# EAGLE design USBASP (EAGLE 6.3)
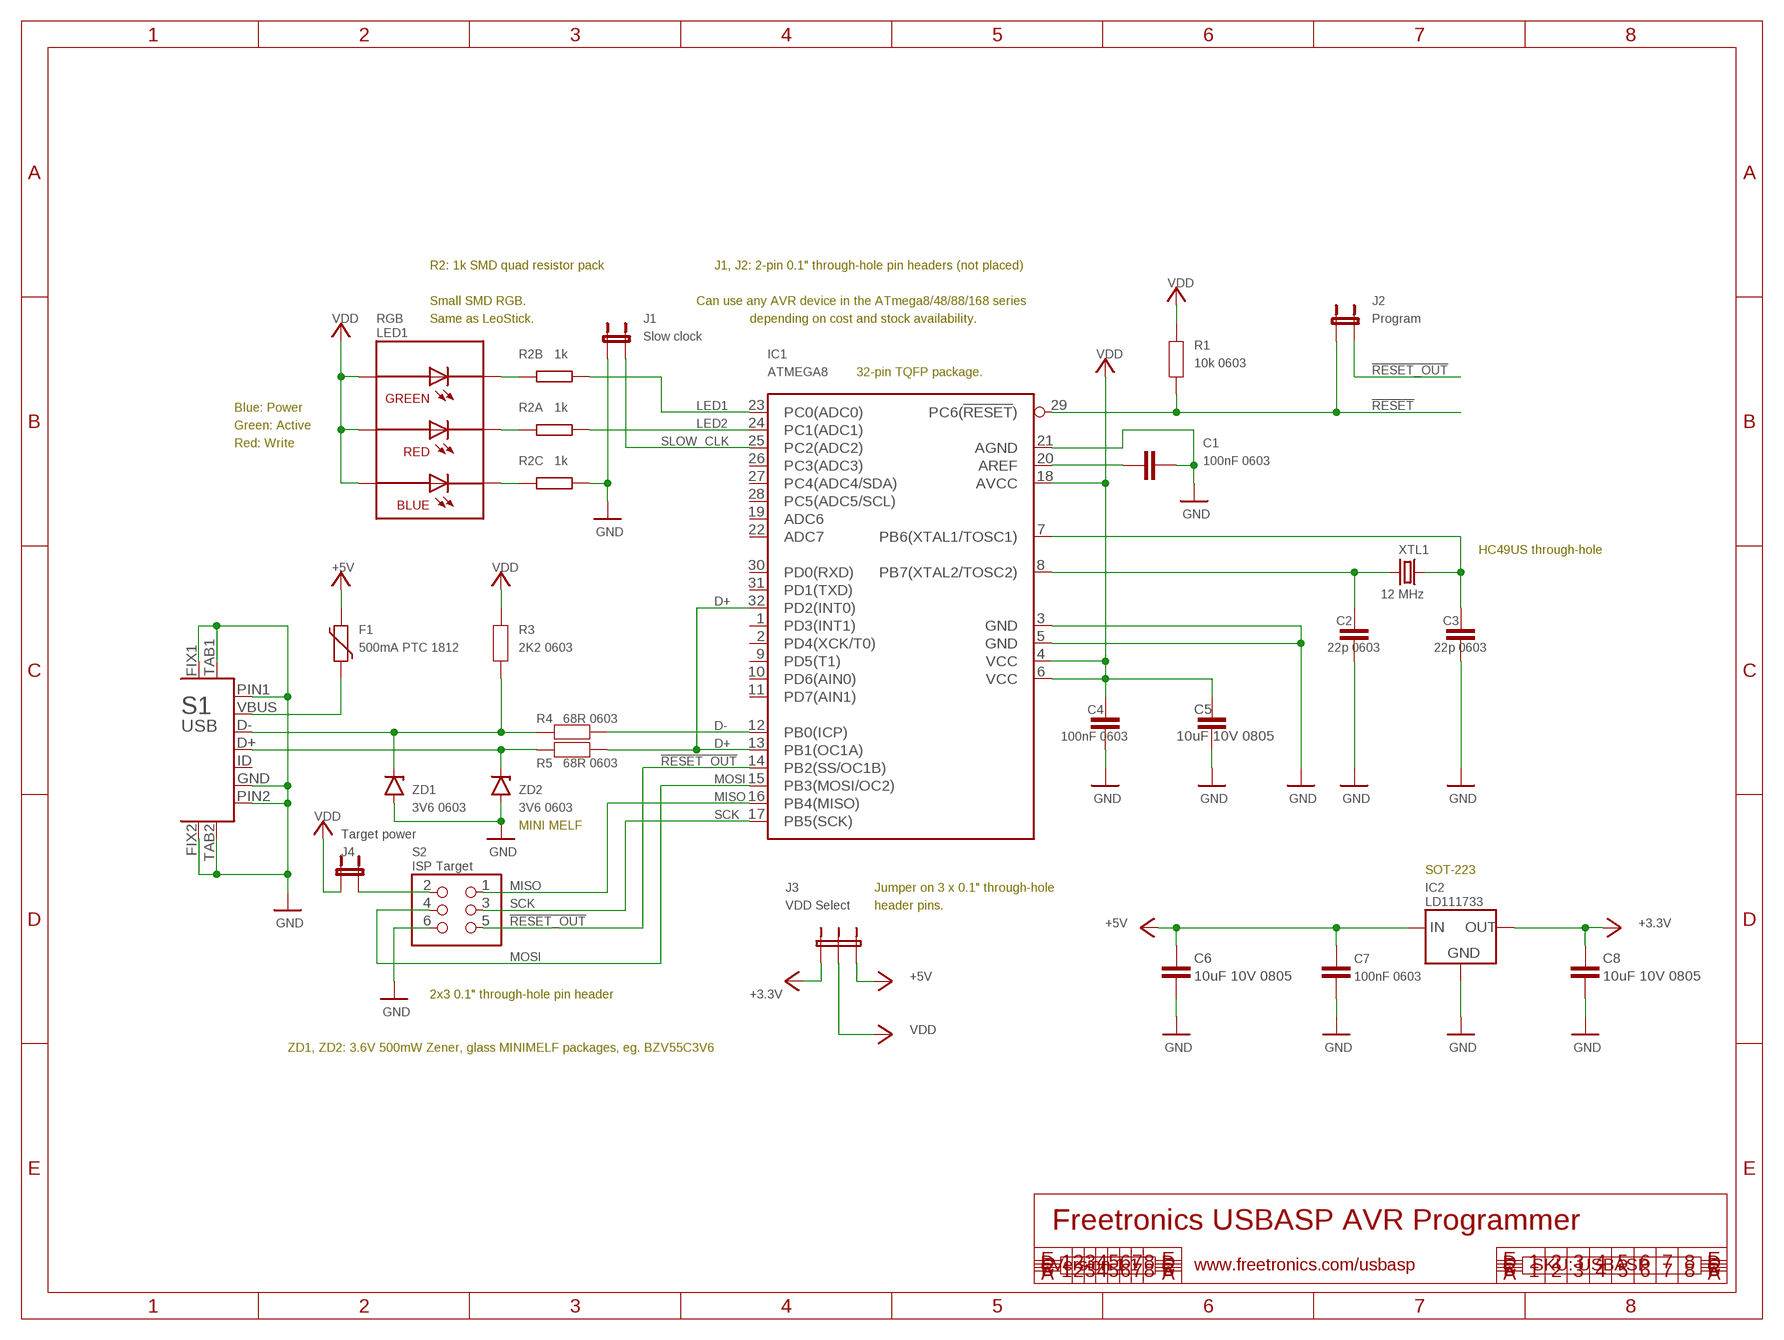
[diagram p0: schematic, sheet 1]

## Parts
C1  100nF 0603  CAP0603  [0603]
C2  22p 0603  CAP0603  [0603]
C3  22p 0603  CAP0603  [0603]
C4  100nF 0603  CAP0603  [0603]
C5  10uF 10V 0805  C-EUC0805  [C0805]
C6  10uF 10V 0805  C-EUC0805  [C0805]
C7  100nF 0603  CAP0603  [0603]
C8  10uF 10V 0805  C-EUC0805  [C0805]
F1  500mA PTC 1812  PTC  [1812]
IC1  ATMEGA8  ATMEGA168  [TQFP32-08]
IC2  LD111733  LD1117-FIXED  [SOT-223]
J1  Slow clock  JUMPER_PTH  [HEADER_1X02]
J2  Program  JUMPER_PTH  [HEADER_1X02]
J3  VDD Select  JUMPER_SPDT  [JUMPER_SPDT]
J4  Target power  JUMPER_PTH  [HEADER_1X02]
LED1  RGB  RGBLEDSMT  [19-337]
R1  10k 0603  RESISTOR0603  [0603]
R2  1k  CAY16  [CAY16]
R3  2K2 0603  RESISTOR0603  [0603]
R4  68R 0603  RESISTOR0603  [0603]
R5  68R 0603  RESISTOR0603  [0603]
S1  USB  USB-6PSMT  [USB-MICROB-MB05PMXX]
S2  ISP Target  HEADER_2X3  [HEADER_2X3]
XTL1  12 MHz  CRYSTALHC49US  [HC49US]
ZD1  3V6 0603  ZENERMINIMELF  [MINIMELF]
ZD2  3V6 0603  ZENERMINIMELF  [MINIMELF]

## Nets
!RESET: IC1.29(PC6(!RESET!)) J2.1 R1.1
!RESET_OUT: IC1.14(PB2(SS/OC1B)) J2.2 S2.5
+3V3: C8.1 IC2.2(OUT) IC2.4(OUT) J3.1 ; supply symbol labelled +3.3V
+5V: C6.1 C7.1 F1.2 IC2.3(IN) J3.3
D+: IC1.13(PB1(OC1A)) IC1.32(PD2(INT0)) R5.1
D-: IC1.12(PB0(ICP)) R4.1
GND: C1.2 C2.1 C3.1 C4.2 C5.2 C6.2 C7.2 C8.2 IC1.3(GND) IC1.5(GND) IC1.21(AGND) IC2.1(GND) J1.1 R2.3 S1.FIX1 S1.FIX2 S1.GND S1.PIN1 S1.PIN2 S1.TAB1 S1.TAB2 S2.6 ZD1.A ZD2.A
LED1: IC1.23(PC0(ADC0)) R2.2
LED2: IC1.24(PC1(ADC1)) R2.1
MISO: IC1.16(PB4(MISO)) S2.1
MOSI: IC1.15(PB3(MOSI/OC2)) S2.4
N$1: LED1.1(C-B) R2.6
N$2: LED1.2(C-R) R2.8
N$3: LED1.3(C-G) R2.7
N$4: J4.2 S2.2
N$138: C3.2 IC1.7(PB6(XTAL1/TOSC1)) XTL1.2
N$139: C2.2 IC1.8(PB7(XTAL2/TOSC2)) XTL1.1
N$141: F1.1 S1.VBUS
N$142: C1.1 IC1.20(AREF)
N$143: R5.2 S1.D+ ZD2.K
N$144: R3.1 R4.2 S1.D- ZD1.K
SCK: IC1.17(PB5(SCK)) S2.3
SLOW_CLK: IC1.25(PC2(ADC2)) J1.2
VDD: C4.1 C5.1 IC1.4(VCC) IC1.6(VCC) IC1.18(AVCC) J3.2 J4.1 LED1.4(A-B) LED1.5(A-R) LED1.6(A-G) R1.2 R3.2
Unconnected: IC1.1(PD3(INT1)) IC1.2(PD4(XCK/T0)) IC1.9(PD5(T1)) IC1.10(PD6(AIN0)) IC1.11(PD7(AIN1)) IC1.19(ADC6) IC1.22(ADC7) IC1.26(PC3(ADC3)) IC1.27(PC4(ADC4/SDA)) IC1.28(PC5(ADC5/SCL)) IC1.30(PD0(RXD)) IC1.31(PD1(TXD)) R2.4 R2.5 S1.ID

## Notes on the sheet
- R2: 1k SMD quad resistor pack | J1, J2: 2-pin 0.1" through-hole pin headers (not placed)
- Small SMD RGB. | Can use any AVR device in the ATmega8/48/88/168 series
- Same as LeoStick. | depending on cost and stock availability.
- 32-pin TQFP package.
- Blue: Power
- Green: Active
- Red: Write
- HC49US through-hole
- MINI MELF
- SOT-223
- Jumper on 3 x 0.1" through-hole
- header pins.
- 2x3 0.1" through-hole pin header
- ZD1, ZD2: 3.6V 500mW Zener, glass MINIMELF packages, eg. BZV55C3V6
- Freetronics USBASP AVR Programmer
- Version 1.1 | www.freetronics.com/usbasp | SKU: USBASP

## Library data of the parts
C1-C4 C7 = freetronics-master-v1:CAP: Capacitor Standard 0603 ceramic capacitor, and 0.1" leaded capacitor.
C5 C6 C8 = freetronics-jon:C-EU: CAPACITOR, European symbol
F1 = freetronics-luke:PTC: Polymeric PTC ("Polyfuse")
IC1 = freetronics-luke:ATMEGA168
IC2 = freetronics-luke:LD1117-FIXED: Fixed-voltage LD1117 series LDOs in SOT-223 package. Note that the ground pin is labelled as ground, not as adj, because it's not the adjustable-voltage part.
J1 J2 J4 = freetronics-luke:JUMPER_PTH: 2-pin (SPST) jumper header, 0.1" pitch through-hole.
J3 = freetronics-luke:JUMPER_SPDT: 3-pin (SPDT) jumper header, 0.1" pitch through-hole.
LED1 = freetronics-master-v1:RGBLED
R1 R3-R5 = freetronics-master-v1:RESISTOR: Resistor Basic schematic elements and footprints for 0603, 1206, and PTH 1/10th watt (small) resistors.
R2 = freetronics-luke:CAY16
S1 = freetronics-jon:USB-6P
S2 = freetronics-luke:HEADER_2X3: 6-pin (2x3) 0.1" male through-hole pin header.
XTL1 = freetronics-master-v1:CRYSTAL: Crystals Various standard crystals. Proven footprints. Spark Fun Electronics SKU : COM-00534
ZD1 ZD2 = freetronics-luke:ZENER

## Net classes
0 default: width 0.152 mm, drill 0.241 mm, clearance 0.152 mm
1 POWER: width 0.305 mm

## Board
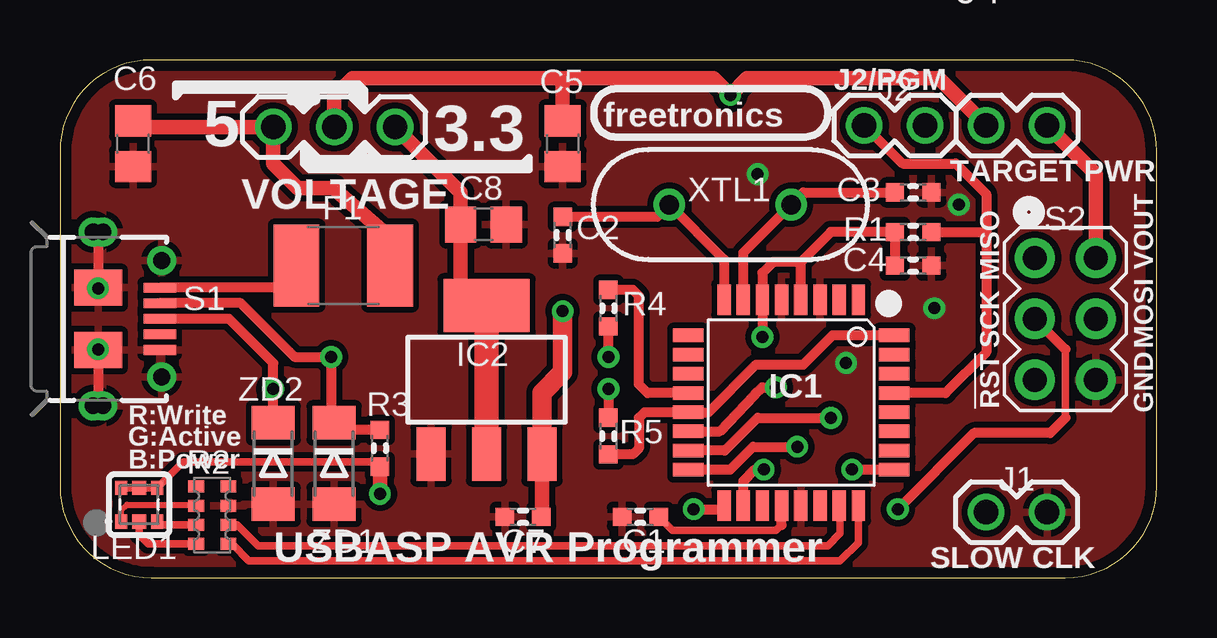
[diagram p1: board, top side]
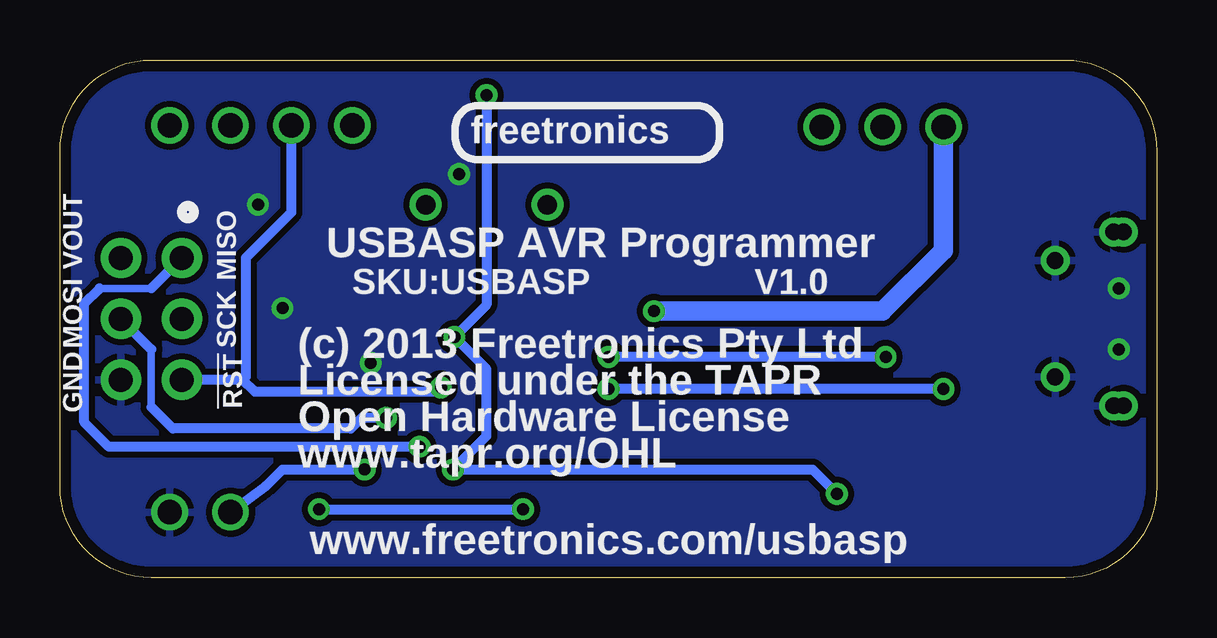
[diagram p2: board, bottom side, seen from below]

Size 45.72 x 21.59 mm. Coordinates in mm from the lower left corner, seen from the top.
Outline: 0,3.81 arc90 3.81,0 41.91,0 arc90 45.72,3.81 45.72,17.78 arc90 41.91,21.59 3.81,21.59 arc90 0,17.78 0,3.81
Copper layers (1*16): Top 0.035mm / dielectric 1.5mm / Bottom 0.035mm
Design rules "default": minimum track width 10mil, minimum drill 15mil, track to track 10mil, track to pad 10mil, pad to pad 10mil, via to via 10mil, smd to smd 8mil, copper to edge 18mil, drill to drill 8mil, minimum pad ring 10mil, minimum via ring 8mil, stop-mask expansion 4mil, vias tented up to drill 25mil, thermal gap 10mil

### Footprints (pad centres in the part's own frame; a part is rotated, then mirrored left to right if it is on the bottom)
0603 = smd 0.762 x 0.762: 1 -0.762,0; 2 0.762,0
C0805 = smd 1.3 x 1.5: 1 -0.95,0; 2 0.95,0
1812 = smd 1.9 x 3.4: 1 -1.95,0; 2 1.95,0
TQFP32-08 = smd 1.27 x 0.559: 1 -4.293,2.8; 2 -4.293,2; 3 -4.293,1.2; 4 -4.293,0.4; 5 -4.293,-0.4; 6 -4.293,-1.2; 7 -4.293,-2; 8 -4.293,-2.8; 17 4.293,-2.8; 18 4.293,-2; 19 4.293,-1.2; 20 4.293,-0.4; 21 4.293,0.4; 22 4.293,1.2; 23 4.293,2; 24 4.293,2.8 | smd 0.559 x 1.27: 9 -2.8,-4.293; 10 -2,-4.293; 11 -1.2,-4.293; 12 -0.4,-4.293; 13 0.4,-4.293; 14 1.2,-4.293; 15 2,-4.293; 16 2.8,-4.293; 25 2.8,4.293; 26 2,4.293; 27 1.2,4.293; 28 0.4,4.293; 29 -0.4,4.293; 30 -1.2,4.293; 31 -2,4.293; 32 -2.8,4.293
SOT-223 = smd 1.219 x 2.235: 1 -2.311,-3.099; 2 0,-3.099; 3 2.311,-3.099 | smd 3.6 x 2.2: 4 0,3.099
HEADER_1X02 = drill 1.016: 1 -1.27,0; 2 1.27,0
JUMPER_SPDT = drill 1.016: 1 -2.54,0; 2 0,0; 3 2.54,0
19-337 = smd 0.6 x 0.5: 1 -0.7,0.75; 3 -0.7,-0.75; 4 0.7,0.75; 6 0.7,-0.75 | smd 0.6 x 0.6: 2 -0.7,0; 5 0.7,0
CAY16 = smd 0.5 x 0.65: 1 -1.2,-0.675; 2 -0.4,-0.675; 3 0.4,-0.675; 4 1.2,-0.675; 5 1.2,0.675; 6 0.4,0.675; 7 -0.4,0.675; 8 -1.2,0.675
USB-MICROB-MB05PMXX = smd 0.4 x 1.35: D+ 0,2.575; D- -0.65,2.575; GND 1.3,2.575; ID 0.65,2.575; VBUS -1.3,2.575 | smd 1.5 x 2: FIX1 -1.3,0; FIX2 1.3,0 | drill 0.7: PIN1 -2.425,2.65; PIN2 2.425,2.65; SLOT1 -3.625,-0.2; SLOT2 3.625,-0.2; TAB1 -3.625,0.2; TAB2 3.625,0.2
HEADER_2X3 = drill 1 pad 1.676: 1 -2.54,-1.27; 2 -2.54,1.27; 3 0,-1.27; 4 0,1.27; 5 2.54,-1.27; 6 2.54,1.27
HC49US = drill 0.813: 1 -2.54,0; 2 2.54,0
MINIMELF = smd 1.4 x 1.8: A 1.7,0; K -1.7,0

### Placement (x,y rotation side)
C1  24.19,2.54 180 top
C2  20.95,14.29 90 top
C3  35.56,16.07 180 top
C4  35.56,13.02 0 top
C5  20.95,18.1 270 top
C6  3.05,18.1 270 top
C7  19.3,2.54 180 top
C8  17.65,14.73 0 top
F1  11.81,13.02 0 top
IC1  30.48,7.3 270 top
IC2  17.78,8.26 0 top
J1  39.88,2.73 180 top
J2  34.8,18.86 0 top
J3  11.43,18.8 180 top
J4  39.88,18.86 0 top
LED1  3.3,3.05 90 top
R1  35.56,14.41 180 top
R2  6.35,2.6 90 top
R3  13.34,5.4 270 top
R4  22.86,11.24 270 top
R5  22.86,5.91 90 top
S1  1.59,10.79 270 top
S2  41.91,10.79 270 top
XTL1  27.94,15.56 0 top
ZD1  11.43,4.76 270 top
ZD2  8.89,4.76 270 top

### Tracks (layer width: path | path; a pad name or v marks a point on that pad's centre or on a via)
!RESET
  Top 0.406: IC1.29 36.91,7.7 38.61,9.4 38.61,14.48 | R1.1 38.54,14.41 38.61,14.48 | J2.1 35.12,17.27 37.34,17.27 38.61,16 38.61,14.48
!RESET_OUT  (via drill 0.5)
  Top 0.406: v29.84,7.94 29.27,7.94 28.96,7.62 27.5,6.1 IC1.14
  Bottom 0.406: 38.1,8.26 S2.5 | 38.1,8.26 37.97,8.38 37.97,13.34 36.07,15.24 J2.2 | v29.84,7.94 30.04,7.75 37.59,7.75 38.1,8.26
+3V3
  Top 0.406: 16.7,11.94 16.7,11.55 17.14,11.11 17.7,11.11
  Top 0.61: 16.7,11.94 C8.1 16.7,16.06 J3.1
  Top 0.813: IC2.4 17.78,11.11
  Top 1.016: 16.7,11.94 16.51,11.75 | 17.7,11.11 17.78,11.11 IC2.2
+5V  (via drill 0.5)
  Top 0.305: C7.1 20.09,2.54
  Top 0.406: C7.1 20.09,2.54
  Top 0.61: 20.09,2.54 IC2.3 | 13.76,14.18 11.68,16 11.43,16.26 9.91,16.26 8.89,17.27 J3.3 3.3,18.8 C6.1
  Top 0.813: v20.95,11.11 20.95,8.57 20.09,7.71 IC2.3 | F1.2 13.76,14.18
  Bottom 0.813: v20.95,11.11 11.43,11.11 8.89,13.65 J3.3
D+
  Top 0.406: R5.1 23.88,5.14 24.13,5.4 24.13,6.67 24.36,6.9 IC1.13 27.03,6.9 29.02,8.89 30.99,8.89 32.2,10.1 IC1.32
D-
  Top 0.406: R4.1 23.88,12 24.13,11.75 24.13,8.06 24.49,7.7 IC1.12
GND  (via drill 0.5)
  Top 0.406: S1.FIX2 1.59,7.17 S1.TAB2 | S1.TAB1 1.59,14.42 S1.FIX1
  other vias: 32.77,8.95 37.47,15.56 36.45,11.24 1.59,9.53 1.59,12.06 29.08,16.83
  pour Top: 0,21.59 45.72,21.59 45.72,0 0,0
  pour Bottom: 0,21.59 45.72,21.59 45.72,0 0,0
LED1
  Top 0.305: 32.51,2.98 32.51,2.86 32.51,1.84 32,1.33 8.26,1.33 7.38,2.2 R2.2
  Top 0.406: IC1.23 32.48,2.89 32.51,2.86
LED2
  Top 0.305: R2.1 7.17,1.4 7.87,0.7 32.51,0.7 33.27,1.46 IC1.24
  Top 0.406: IC1.24
MISO  (via drill 0.5)
  Top 0.406: IC1.16 27.93,4.5 28.89,5.46 v30.73,5.46
  Bottom 0.305: 44.07,12.06 41.91,12.06
  Bottom 0.406: 44.07,12.06 44.7,11.43 44.7,6.48 43.69,5.46 v30.73,5.46 | 41.91,12.06 S2.1
MOSI  (via drill 0.5)
  Top 0.406: v32.13,6.67 29.08,6.67 27.72,5.3 IC1.15
  Bottom 0.305: 41.91,7.11 41.91,9.53
  Bottom 0.406: v32.13,6.67 33.15,6.67 33.59,6.22 41.02,6.22 41.91,7.11 | 41.91,9.53 S2.4
N$1
  Top 0.254: LED1.1 2.55,2.81 2.79,3.05 5.63,3.05
  Top 0.305: 5.63,3.05 arc-90 R2.6
N$2
  Top 0.305: LED1.2 3.3,1.78 3.68,1.4 R2.8
N$3
  Top 0.305: 4.05,2.3 LED1.3 4.2,2.2 R2.7
N$4
  Top 0.61: J4.2 43.18,16.83 S2.2
N$138
  Top 0.406: IC1.7 28.48,13.56 XTL1.2 30.99,16.07 C3.2
N$139
  Top 0.406: IC1.8 27.68,13.28 XTL1.1 24.89,15.05 C2.2
N$141
  Top 0.406: F1.1 8.94,12.1 S1.VBUS
N$142
  Top 0.305: 30.08,2.2 29.84,1.97 25.53,1.97 C1.1
  Top 0.406: 30.08,2.2 IC1.20
N$143  (via drill 0.5)
  Top 0.406: v22.86,7.87 R5.2 | ZD2.K v8.89,7.87 8.89,8.95 7.05,10.79 S1.D+
  Bottom 0.406: v8.89,7.87 v22.86,7.87
N$144  (via drill 0.5)
  Top 0.406: 11.44,6.54 ZD1.K | v22.86,9.21 R4.2 | ZD1.K 11.3,6.59 v11.3,9.21 9.78,9.21 7.54,11.45 S1.D- | R3.1 11.73,6.16 ZD1.K
  Bottom 0.406: v11.3,9.21 v22.86,9.21
SCK  (via drill 0.5)
  Top 0.305: 41.91,6.67 41.91,9.53
  Top 0.406: v34.92,2.86 38.1,6.03 41.27,6.03 41.91,6.67 | v26.42,2.86 27.53,2.86 IC1.17 | 41.91,9.53 S2.3
  Bottom 0.406: v34.92,2.86 v26.42,2.86
SLOW_CLK  (via drill 0.5)
  Top 0.406: v33.02,4.51 IC1.25
  Bottom 0.406: v33.02,4.51 36.45,4.51 37.15,3.81 J1.2
VDD  (via drill 0.5)
  Top 0.305: LED1.4 LED1.5 LED1.6 5.13,4.83 13.14,4.83 arc-90 R3.2
  Top 0.406: 30.88,13.16 29.74,13.16 29.28,12.71 IC1.6 v29.28,10.04 | 30.88,13.16 32.13,14.41 R1.2 C4.1 | IC1.18 28.48,4.03 28.96,4.51 v29.34,4.51 | IC1.4 30.88,13.16
  Top 0.61: R3.2 v13.34,3.49 | C5.1 20.95,20.7 20.83,20.83 | J3.2 11.43,20.07 12.19,20.83 20.83,20.83 | 20.83,20.83 27.24,20.83 v27.94,20.13 28.64,20.83 36.64,20.83 J4.1
  Bottom 0.406: v13.34,3.49 14.35,4.51 v29.34,4.51 27.94,5.91 27.94,8.7 v29.28,10.04 27.94,11.38 v27.94,20.13

### Text on the board
tPlace: J2/PGM | freetronics | 5 | 3.3 | TARGET | PWR | VOLTAGE | VOUT | MISO | SCK | MOSI | !RST | GND | G:Active | R:Write | B:Power | USBASP AVR Programmer | SLOW CLK
bPlace: freetronics | USBASP AVR Programmer | VOUT | V1.0 | SKU:USBASP | MISO | SCK | MOSI | (c) 2013 Freetronics Pty Ltd | Licensed under the TAPR | !RST | GND | Open Hardware License | www.tapr.org/OHL | www.freetronics.com/usbasp
tNames: LED1